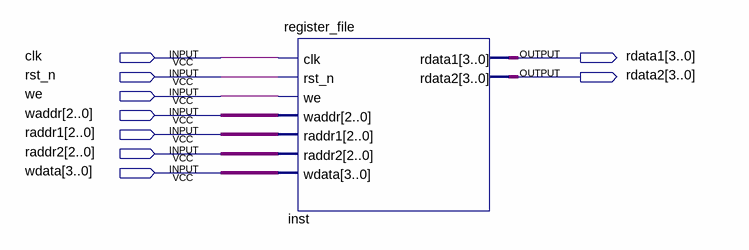
[diagram p0: schematic sheet]
// Quartus schematic step2.bdf as structural Verilog: 1 symbols, 9 pins
module step2 (
  input  clk,
  input  rst_n,
  input  we,
  input  [2:0] waddr,
  input  [2:0] raddr1,
  input  [2:0] raddr2,
  input  [3:0] wdata,
  output [3:0] rdata1,
  output [3:0] rdata2
);

  register_file inst (
    .clk(clk), .rst_n(rst_n), .we(we), .waddr(waddr), .raddr1(raddr1), .raddr2(raddr2), .wdata(wdata),
    .rdata1(rdata1), .rdata2(rdata2));
endmodule
